# Altium schematic sheet ALCS_REMOTE v2.SchDoc
size C; PageSetup: Record=PageOptions|CenterHorizontal=True|CenterVertical=True|PrintScale=0.87|XCorrection=1.00|YCorrection=1.00|PrintKind=2|BorderSize=5000000|LeftOffset=0|BottomOffset=0|Orientation=2|PaperLength=1000|PaperWidth=1000|Scale=100|PaperSource=7|PrintQuality=-3|MediaType=1|DitherType=10|PrintScaleMode=1|PaperKind=A3|PaperIndex=8
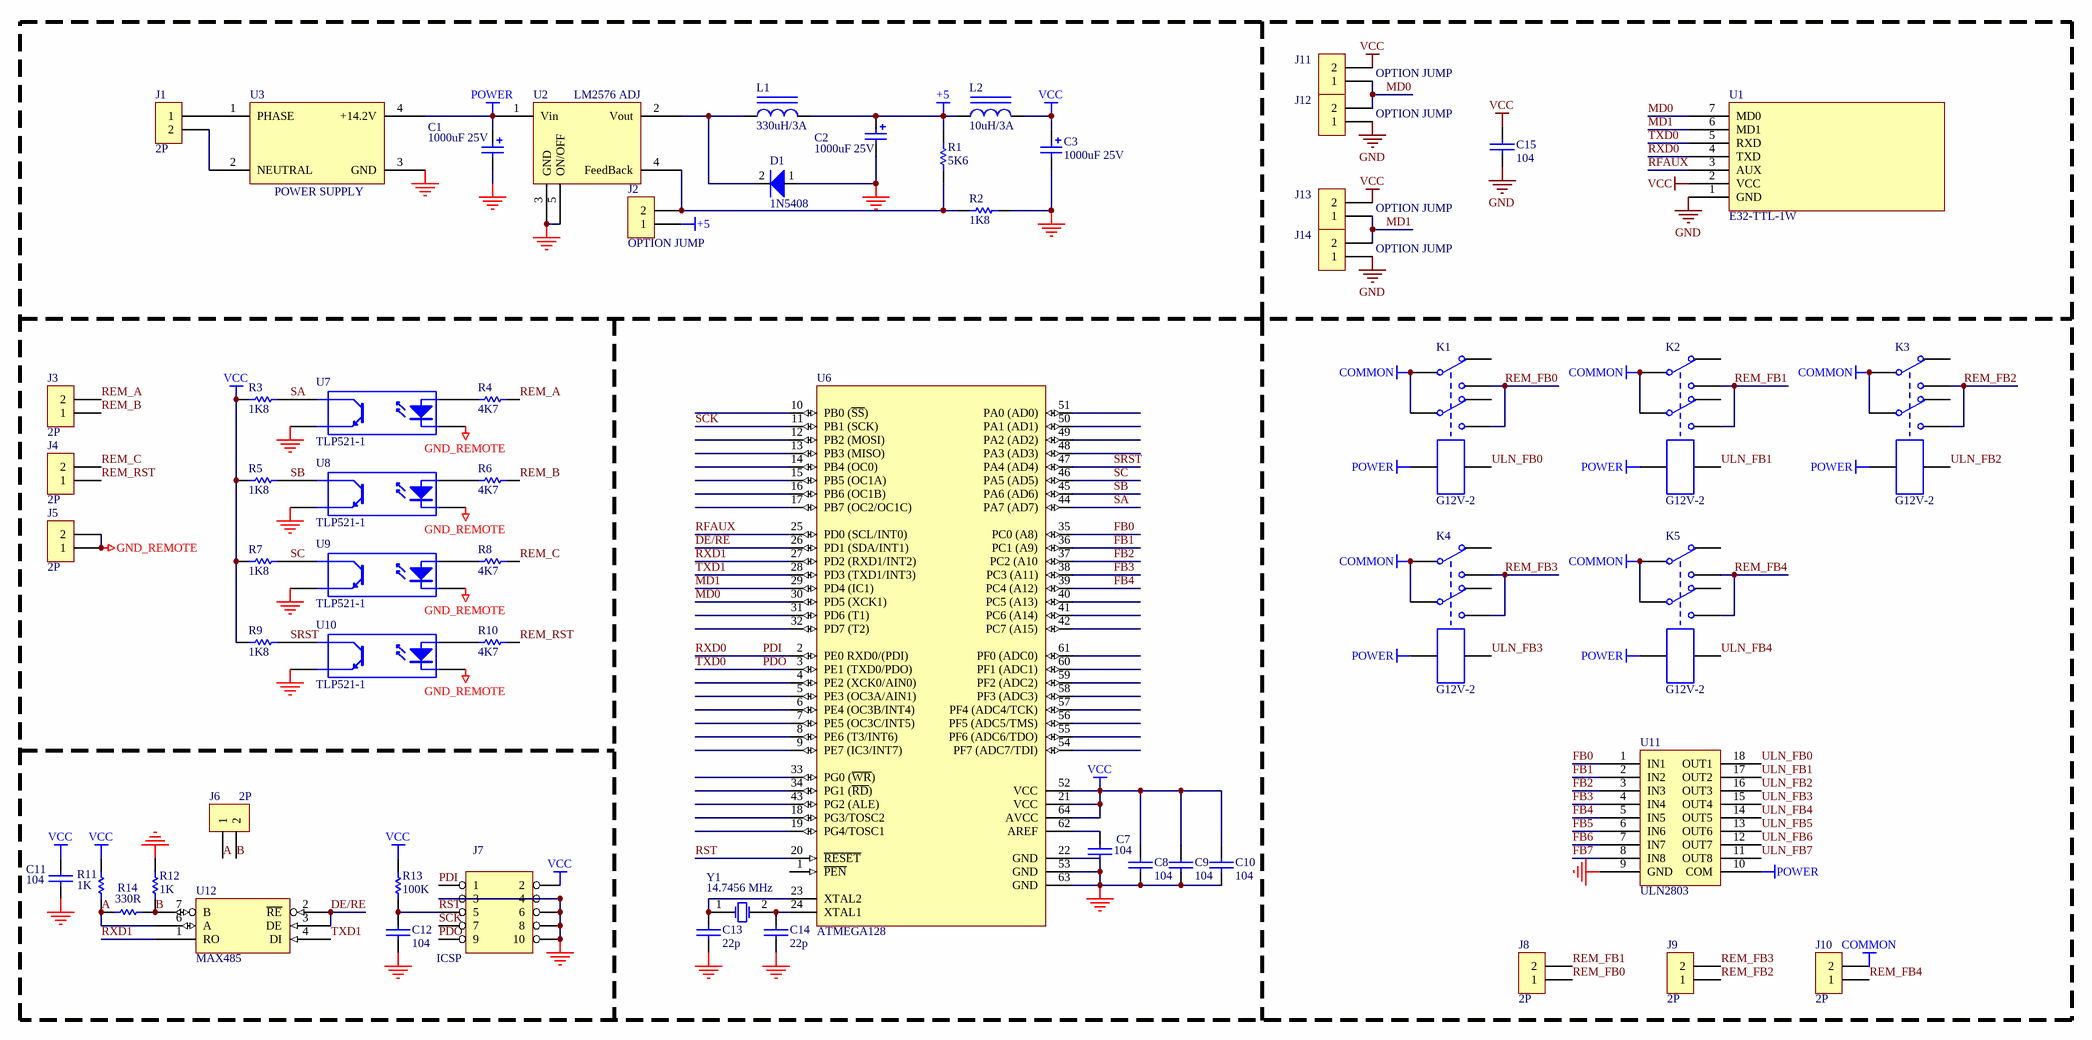
[diagram p0: ALCS_REMOTE v2.SchDoc]

## Parts
C1  value 1000uF 25V  [CAP40x20]
C2  value 1000uF 25V  [CAP40x20]
C3  value 1000uF 25V  [CAP40x20]
C7  value 104  [0805C]
C8  value 104  [0805C]
C9  value 104  [0805C]
C10  value 104  [0805C]
C11  value 104  [0805C]
C12  value 104  [0805C]
C13  value 22p  [0805C]
C14  value 22p  [0805C]
C15  value 104  [0805C]
D1  value 1N5408  [1N5408]
J1  value 2P  [JACK2_CAM]
J2  value OPTION JUMP  [XPAD]
J3  value 2P  [JACK2_CAM]
J4  value 2P  [JACK2_CAM]
J5  value 2P  [JACK2_CAM]
J6  value 2P  [JACK2_CAM]
J7  value ICSP  [HDR2x5]  (hidden comment: Jump đực chân thẳng, 2 hàng chân 2.54mm 10P)
J8  value 2P  [JACK2_CAM]
J9  value 2P  [JACK2_CAM]
J10  value 2P  [JACK2_CAM]
J11  value OPTION JUMP  [XPAD]
J12  value OPTION JUMP  [XPAD]
J13  value OPTION JUMP  [XPAD]
J14  value OPTION JUMP  [XPAD]
K1  value G12V-2  [RELAY]
K2  value G12V-2  [RELAY]
K3  value G12V-2  [RELAY]
K4  value G12V-2  [RELAY]
K5  value G12V-2  [RELAY]
L1  value 330uH/3A  [CAMTRONDUNG]
L2  value 10uH/3A  [CAMTRONDUNG]
R1  value 5K6  [0805DD]
R2  value 1K8  [0805DD]
R3  value 1K8  [0805DD]
R4  value 4K7  [0805DD]
R5  value 1K8  [0805DD]
R6  value 4K7  [0805DD]
R7  value 1K8  [0805DD]
R8  value 4K7  [0805DD]
R9  value 1K8  [0805DD]
R10  value 4K7  [0805DD]
R11  value 1K  [0805DD]
R12  value 1K  [0805DD]
R13  value 100K  [0805DD]
R14  value 330R  [0805DD]
U1  value E32-TTL-1W  [RF_AS32]
U2  value LM2576 ADJ  [TO220_5CSMD2]
U3  value POWER SUPPLY  [PS15V2A]  (hidden comment: Module nguồn AC-DC 14.2V)
U6  value ATMEGA128  [QFP64-3]
U7  value TLP521-1  [TLP521_1]
U8  value TLP521-1  [TLP521_1]
U9  value TLP521-1  [TLP521_1]
U10  value TLP521-1  [TLP521_1]
U11  value ULN2803  [SO-J18/C9.6]
U12  value MAX485  [SO-8]
Y1  value 14.7456 MHz  [XTAL]

## Nets
+5: C2.1 J2.1 L1.2 L2.1 R1.2
COMMON: J10.2 K1.1 K1.4 K2.1 K2.4 K3.1 K3.4 K4.1 K4.4 K5.1 K5.4
GND: C1.2 C2.2 C3.2 C7.2 C8.1 C9.2 C10.2 C11.2 C12.2 C13.1 C14.1 C15.2 D1.1(A) J7.3 J7.4 J7.6 J7.8 J7.10 J12.1 J14.1 R2.1 R12.2 U1.1(GND) U2.3(GND) U2.5(ON/OFF) U3.3(GND) U6.22(GND) U6.53(GND) U6.63(GND) U7.3(C) U8.3(C) U9.3(C) U10.3(C) U11.9(GND) U12.5(GND)
GND_REMOTE: J5.1 J5.2 U7.2(K) U8.2(K) U9.2(K) U10.2(K)
POWER: C1.1 K1.7 K2.7 K3.7 K4.7 K5.7 U2.1(Vin) U3.4(+14.2V) U11.10(COM)
VCC: C3.1 C8.2 C9.1 C10.1 C11.1 C15.1 J7.2 J11.2 J13.2 L2.2 R3.1 R5.1 R7.1 R9.1 R11.1 R13.2 U1.2(VCC) U6.21(VCC) U6.52(VCC) U6.64(AVCC) U12.8(VCC)
A: J6.1 R11.2 R14.1 U12.6(A)
B: J6.2 R12.1 R14.2 U12.7(B)
DE/RE: U6.26(PD1_(SDA/INT1)) U12.2(~{RE}) U12.3(DE)
FB0: U6.35(PC0_(A8)) U11.1(IN1)
FB1: U6.36(PC1_(A9)) U11.2(IN2)
FB2: U6.37(PC2_(A10) U11.3(IN3)
FB3: U6.38(PC3_(A11)) U11.4(IN4)
FB4: U6.39(PC4_(A12)) U11.5(IN5)
FB5: U11.6(IN6)
FB6: U11.7(IN7)
FB7: U11.8(IN8)
MD0: J11.1 J12.2 U1.7(MD0) U6.30(PD5_(XCK1))
MD1: J13.1 J14.2 U1.6(MD1) U6.29(PD4_(IC1))
PDI: J7.1 U1.4(TXD) U6.2(PE0_RXD0/(PDI))  [also labelled RXD0]
PDO: J7.9 U1.5(RXD) U6.3(PE1_(TXD0/PDO))  [also labelled TXD0]
REM_A: J3.2 R4.2
REM_B: J3.1 R6.2
REM_C: J4.2 R8.2
REM_FB0: J8.1 K1.3 K1.6
REM_FB1: J8.2 K2.3 K2.6
REM_FB2: J9.1 K3.3 K3.6
REM_FB3: J9.2 K4.3 K4.6
REM_FB4: J10.1 K5.3 K5.6
REM_RST: J4.1 R10.2
RFAUX: U1.3(AUX) U6.25(PD0_(SCL/INT0))
RST: C12.1 J7.5 R13.1 U6.20(~{RESET})
RXD1: U6.27(PD2_(RXD1/INT2)) U12.1(RO)
SA: R3.2 U6.44(PA7_(AD7)) U7.4(E)
SB: R5.2 U6.45(PA6_(AD6)) U8.4(E)
SC: R7.2 U6.46(PA5_(AD5)) U9.4(E)
SCK: J7.7 U6.11(PB1_(SCK))
SRST: R9.2 U6.47(PA4_(AD4)) U10.4(E)
TXD1: U6.28(PD3_(TXD1/INT3)) U12.4(DI)
ULN_FB0: K1.8 U11.18(OUT1)
ULN_FB1: K2.8 U11.17(OUT2)
ULN_FB2: K3.8 U11.16(OUT3)
ULN_FB3: K4.8 U11.15(OUT4)
ULN_FB4: K5.8 U11.14(OUT5)
ULN_FB5: U11.13(OUT6)
ULN_FB6: U11.12(OUT7)
ULN_FB7: U11.11(OUT8)
NetC7_1: C7.1 U6.62(AREF)
NetC13_2: C13.2 U6.23(XTAL2) Y1.1(OSC1)
NetC14_2: C14.2 U6.24(XTAL1) Y1.2(OSC2)
NetD1_2: D1.2(K) L1.1 U2.2(Vout)
NetJ1_1: J1.1 U3.1(PHASE)
NetJ1_2: J1.2 U3.2(NEUTRAL)
NetJ2_2: J2.2 R1.1 R2.2 U2.4(FeedBack)
NetR4_1: R4.1 U7.1(A)
NetR6_1: R6.1 U8.1(A)
NetR8_1: R8.1 U9.1(A)
NetR10_1: R10.1 U10.1(A)

Not connected (* = marked no-connect by the designer): K1 2 5; K2 2 5; K3 2 5; K4 2 5; K5 2 5; U6 1(~{PEN}) 4(PE2_(XCK0/AIN0)) 5(PE3_(OC3A/AIN1)) 6(PE4_(OC3B/INT4)) 7(PE5_(OC3C/INT5)) 8(PE6_(T3/INT6)) 9(PE7_(IC3/INT7)) 10(PB0_(~{SS})) 12(PB2_(MOSI)) 13(PB3_(MISO)) 14(PB4_(OC0)) 15(PB5_(OC1A)) 16(PB6_(OC1B)) 17(PB7_(OC2/OC1C)) 18(PG3/TOSC2) 19(PG4/TOSC1) 31(PD6_(T1)) 32(PD7_(T2)) 33(PG0_(~{WR})) 34(PG1_(~{RD})) 40(PC5_(A13)) 41(PC6_(A14)) 42(PC7_(A15)) 43(PG2_(ALE)) 48(PA3_(AD3)) 49(PA2_(AD2)) 50(PA1_(AD1)) 51(PA0_(AD0)) 54(PF7_(ADC7/TDI)) 55(PF6_(ADC6/TDO)) 56(PF5_(ADC5/TMS)) 57(PF4_(ADC4/TCK)) 58(PF3_(ADC3)) 59(PF2_(ADC2)) 60(PF1_(ADC1)) 61(PF0_(ADC0))

## Library data of the parts
C1-C3 = Cap Pol1: Polarized Capacitor (Radial); Type1: Tụ hóa chân cắm; Type2: Tụ hóa chân dán; Published: *; LatestRevisionDate: *; LatestRevisionNote: *; PackageReference: *; Publisher: *
C7-C15 = CAP: Type1: Tụ điện dán 0805; Type2: Tụ điện chân cắm
D1 = DIODE: Type1: Diode xung chân cắm 3A; Type2: Diode chỉnh lưu chân cắm 1A; Type3: Diode chỉnh lưu chân cắm 3A
J1-J6 J8-J14 = CON2: Type1: Giắc xanh loại nằm, 300V/16A - 5.08mm; Type2: Jump đực loại thẳng, 2.54mm; Type3: Jumper; Type4: Giắc xanh loại nằm, 300V/16A - 3.81mm
J7 = HEADER 5X2
K1-K5 = Relay-DPDT: Dual-Pole Dual-Throw Relay; Type1: Relay OMRON, 8 chân cắm; Published: *; LatestRevisionDate: *; LatestRevisionNote: *; PackageReference: *; Publisher: *; Type2: *
L1 L2 = INDUCTORSMALL: Type1: Cuộn cảm chân cắm lõi trụ; Type2: Cuộn cảm chân cắm lõi xuyến
R1-R14 = Res Semi: Semiconductor Resistor; Type1: Điện trở dán 0805; Type2: Điện trở chân cắm 1/4W; Type3: Điện trở chân cắm 2W; Published: *; LatestRevisionDate: *; LatestRevisionNote: *; PackageReference: *; Publisher: *
U1 = AS32-TTL-1W: Type1: Module thu phát không dây RF
U2 = LM2576: Type1: IC chuyển đổi nguồn, chân dán; Type2: IC chuyển đổi nguồn, chân cắm
U3 = SACACQUY
U6 = ATmega64-16AC: 8-Bit AVR Microcontroller with 64K Bytes of In-System Programmable Flash Memory; Type1: Vi điều khiển ATMEL chân dán; Published: *; LatestRevisionDate: *; LatestRevisionNote: *; DatasheetVersion: *; PackageVersion: *; PackageReference: *; Publisher: *; PackageDescription: *; Code_JEDEC: *; ComponentLink1Description: *; ComponentLink1URL: *; ComponentLink2Description: *; ComponentLink2URL: *
U7-U10 = OPTOISO1: Optoisolator; Type1: Cách ly quang chân cắm
U11 = ULN2803: Type1: IC đệm chân dán; Type2: IC đệm chân cắm
U12 = DS75176BN(8): Multipoint RS-485/RS-422 Transceivers; Type1: IC truyền thông chân dán; Type2: IC truyền thông chân cắm
Y1 = XTAL: Crystal Oscillator; Type1: Thạch anh chân cắm; Type2: Thạch anh chân dán; Published: *; LatestRevisionDate: *; LatestRevisionNote: *; PackageReference: *; Publisher: *